# Altium schematic sheet SH31 - POWER II.SchDoc
size 386 x 246 mm
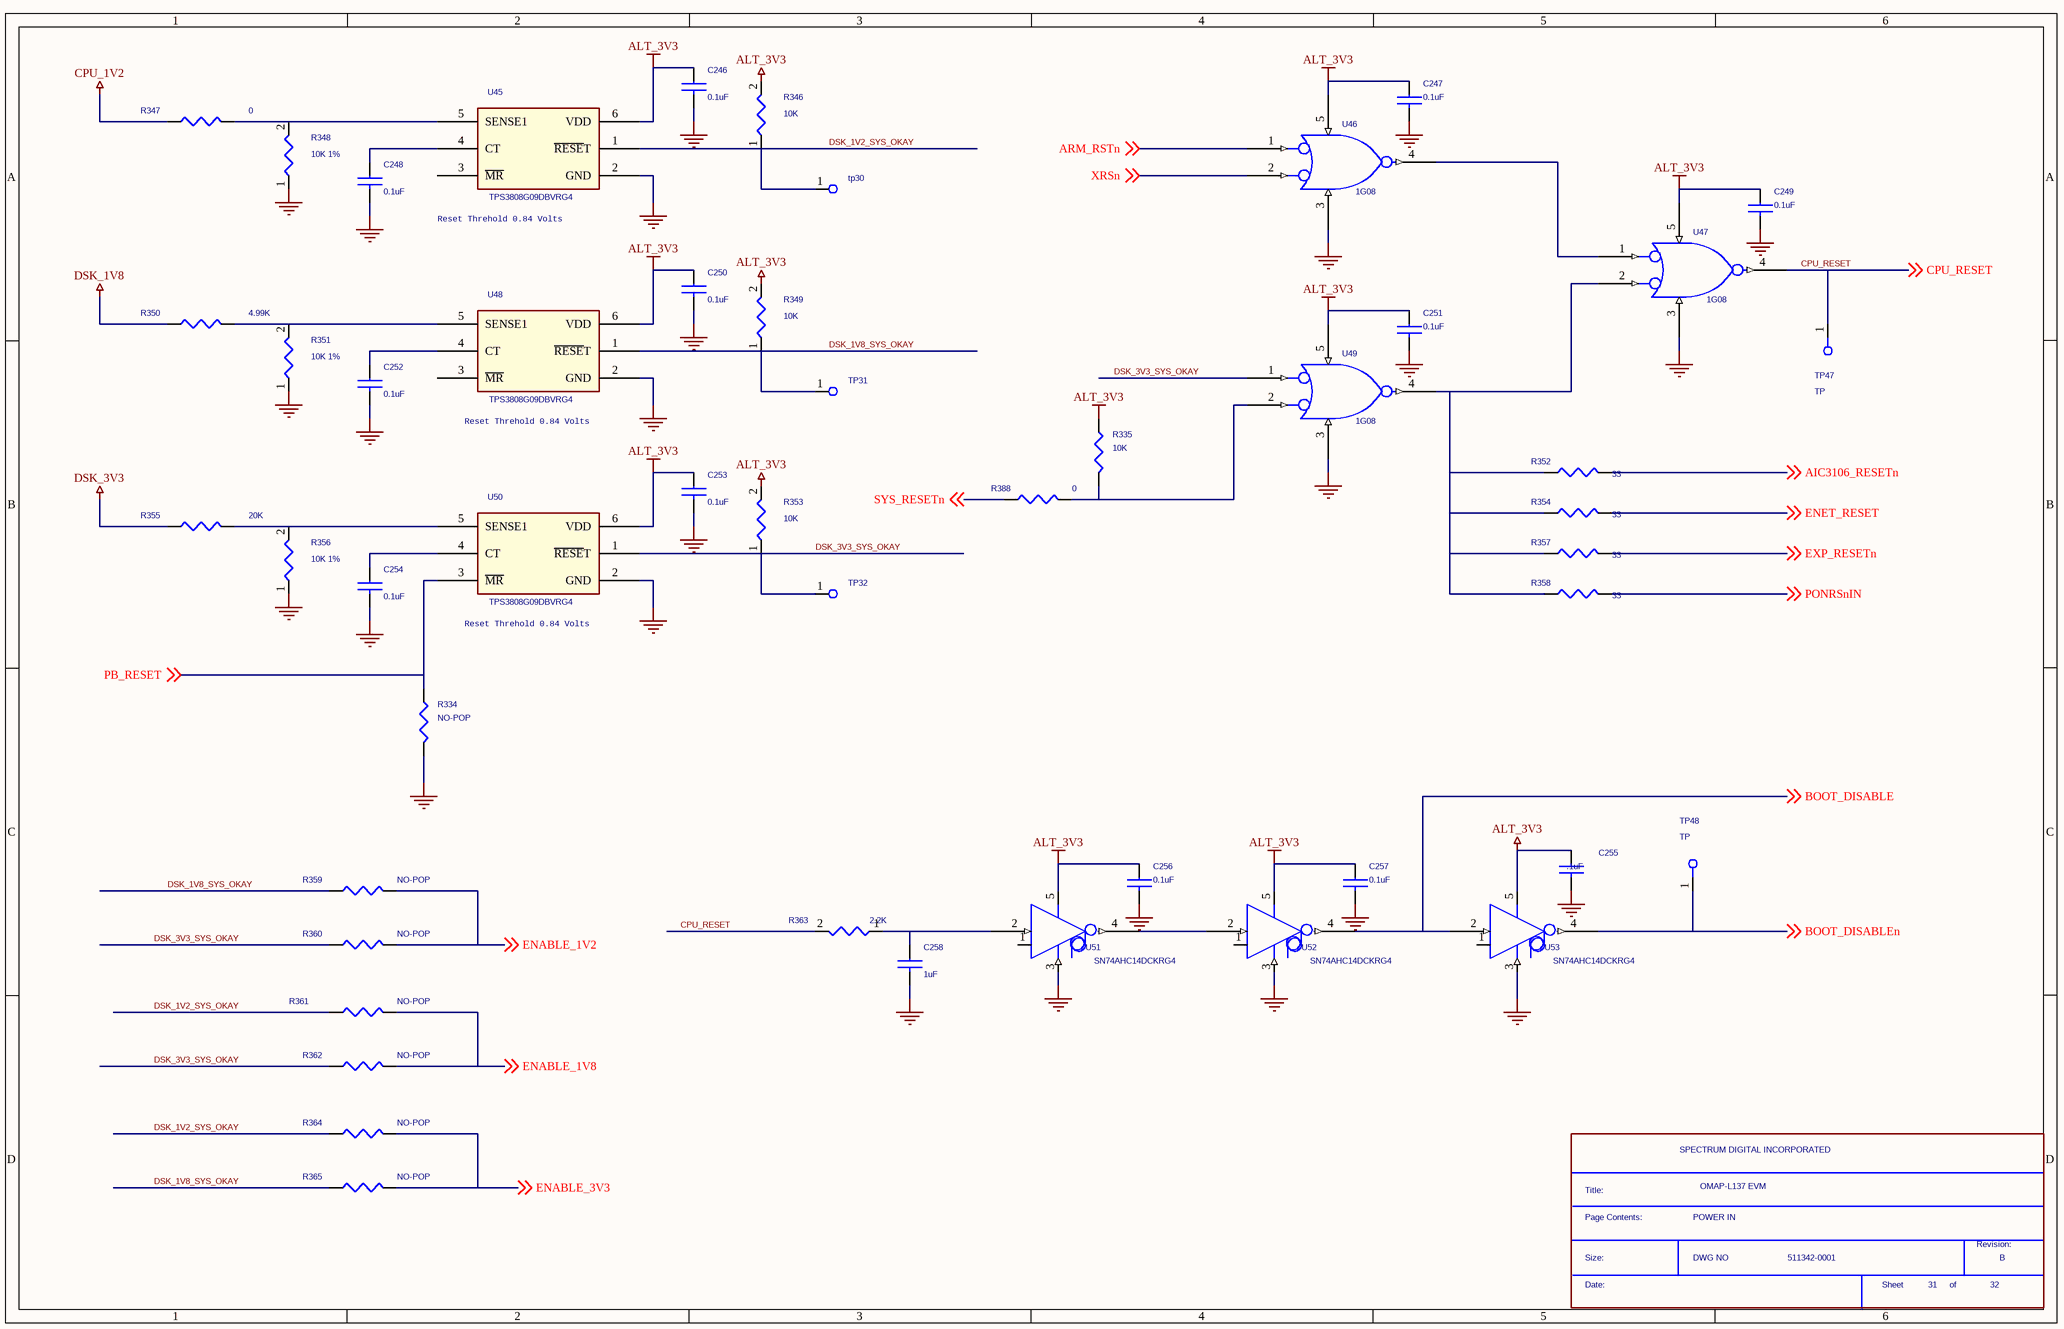
[diagram p0: SH31 - POWER II.SchDoc]

## Parts
*  Page Contents:: POWER IN  RevCode: B  Title: OMAP-L137 EVM  OrgName: SPECTRUM DIGITAL INCORPORATED  Doc: 511342-0001  Page Number: 31  Page Count: 32  (hidden comment: SDTitleBlock)  (graphical)
C246  0.1uF  [c402-25]
C247  0.1uF  [c402-25]
C248  0.1uF  [c402-25]
C249  0.1uF  [c402-25]
C250  0.1uF  [c402-25]
C251  0.1uF  [c402-25]
C252  0.1uF  [c402-25]
C253  0.1uF  [c402-25]
C254  0.1uF  [c402-25]
C255  .1uF  [c402-25]
C256  0.1uF  [c402-25]
C257  0.1uF  [c402-25]
C258  1uF  [c402-25]
R334  NO-POP  [r402-25]
R335  10K  [r402-25]
R346  10K  [r402-25]
R347  0  [r402-25]
R348  10K 1%  [r402-25]
R349  10K  [r402-25]
R350  4.99K  [r603-35x45]
R351  10K 1%  [r402-25]
R352  33  [r402-25]
R353  10K  [r402-25]
R354  33  [r402-25]
R355  20K  [r402-25]
R356  10K 1%  [r402-25]
R357  33  [r402-25]
R358  33  [r402-25]
R359  NO-POP  [r402-25]
R360  NO-POP  [r402-25]
R361  NO-POP  [r402-25]
R362  NO-POP  [r402-25]
R363  2.2K  [r402-25]
R364  NO-POP  [r402-25]
R365  NO-POP  [r402-25]
R388  0  [r402-25]
tp30  TestPoint1  [TP1_0-2_0]  (value not drawn)
TP31  TestPoint1  [TP1_0-2_0]  (value not drawn)
TP32  TestPoint1  [TP1_0-2_0]  (value not drawn)
TP47  TP  [tp1-6040]
TP48  TP  [tp1-6040]
U45  TPS3808G09DBVRG4  [DBV6-27X39-6]
U46  1G08  [SO5]
U47  1G08  [SO5]
U48  TPS3808G09DBVRG4  [DBV6-27X39-6]
U49  1G08  [SO5]
U50  TPS3808G09DBVRG4  [DBV6-27X39-6]
U51  SN74AHC14DCKRG4  [DCK]
U52  SN74AHC14DCKRG4  [DCK]
U53  SN74AHC14DCKRG4  [DCK]

## Nets
ALT_3V3: C246.1 C247.1 C249.1 C250.1 C251.1 C253.1 C255.1 C256.1 C257.1 R335.1 R346.2 R349.2 R353.2 U45.6(VDD) U46.5(VCC) U47.5(VCC) U48.6(VDD) U49.5(VCC) U50.6(VDD) U51.5(VCC) U52.5(VCC) U53.5(VCC)
CPU_1V2: R347.1
DSK_1V8: R350.1
DSK_3V3: R355.1
GND: C246.2 C247.2 C248.2 C249.2 C250.2 C251.2 C252.2 C253.2 C254.2 C255.2 C256.2 C257.2 C258.2 R334.2 R348.1 R351.1 R356.1 U45.2(GND) U46.3(GND) U47.3(GND) U48.2(GND) U49.3(GND) U50.2(GND) U51.3(GND) U52.3(GND) U53.3(GND)
AIC3106_RESETn: R352.1 ; off-sheet AIC3106_RESETn
ARM_RSTn: U46.1(B) ; off-sheet ARM_RSTn
BOOT_DISABLE: U52.4(O) U53.2(I) ; off-sheet BOOT_DISABLE
BOOT_DISABLEn: TP48.1 U53.4(O) ; off-sheet BOOT_DISABLEn
CPU_RESET: R363.2 TP47.1 U47.4(Y) ; off-sheet CPU_RESET
DSK_1V2_SYS_OKAY: R346.1 R361.1 R364.1 tp30.1 U45.1(~{RESE}T)
DSK_1V8_SYS_OKAY: R349.1 R359.1 R365.1 TP31.1 U48.1(~{RESE}T)
DSK_3V3_SYS_OKAY: R353.1 R360.1 R362.1 TP32.1 U49.1(B) U50.1(~{RESE}T)
ENABLE_1V2: R359.2 R360.2 ; off-sheet ENABLE_1V2
ENABLE_1V8: R361.2 R362.2 ; off-sheet ENABLE_1V8
ENABLE_3V3: R364.2 R365.2 ; off-sheet ENABLE_3V3
ENET_RESET: R354.1 ; off-sheet ENET_RESET
EXP_RESETn: R357.1 ; off-sheet EXP_RESETn
PB_RESET: R334.1 U50.3(~{MR}) ; off-sheet PB_RESET
PONRSnIN: R358.1 ; off-sheet PONRSnIN
SYS_RESETn: R388.1 ; off-sheet SYS_RESETn
XRSn: U46.2(A) ; off-sheet XRSn
NetC248_1: C248.1 U45.4(CT)
NetC252_1: C252.1 U48.4(CT)
NetC254_1: C254.1 U50.4(CT)
NetC258_1: C258.1 R363.1 U51.2(I)
NetR335_2: R335.2 R388.2 U49.2(A)
NetR347_2: R347.2 R348.2 U45.5(SENSE1)
NetR350_2: R350.2 R351.2 U48.5(SENSE1)
NetR352_2: R352.2 R354.2 R357.2 R358.2 U47.2(A) U49.4(Y)
NetR355_2: R355.2 R356.2 U50.5(SENSE1)
NetU46_4: U46.4(Y) U47.1(B)
NetU51_4: U51.4(O) U52.2(I)

Not connected (* = marked no-connect by the designer): U45 3(~{MR}); U48 3(~{MR}); U51 1(NC1); U52 1(NC1); U53 1(NC1)

## Notes on the sheet
- (near U45) Reset Threhold 0.84 Volts
- (near U48) Reset Threhold 0.84 Volts
- (near U50) Reset Threhold 0.84 Volts
- (in symbol SDTitleBlock) Title:; Page Contents:; Revision:; Size:; DWG NO; Date:; Sheet; of

## Library data of the parts
C246 C248 C250 C252-C254 C258 = CAP NP_2: Part #: 101587-1100R; SD PCB Footprint: EIA0603
C247 C249 C251 C256 C257 = CAP NP_0: Capacitor, Ceramic, 16V, X7R, 10%; Part #: 101587-1100R
C255 = CAP NP_2: Part #: 101587-1100R
R334 R359-R362 R364 R365 = R: Part #: R0402-NOPOP
R335 = R: Part #: 101370-1003R
R346 R349 R353 = R_2: Part #: 101370-1003R; SD PCB Footprint: EIA0603
R347 R388 = R: Part #: 101370-0001R
R348 R351 R356 = R_2: Part #: 102145-1003R; SD PCB Footprint: EIA0603
R350 = R: Part #: 100642-4992R
R352 R354 R357 R358 = R_1: Resistor, 5%, 1/16W; Part #: 101370-3300R
R355 = R: Part #: 101370-2003R
R363 = R_2: Part #: 101370-2202R; SD PCB Footprint: EIA0603
tp30 TP31 TP32 = TestPoint1: Part #: 100115-0001R; ATLStockNo1: none
TP47 TP48 = TP_0
U45 U48 U50 = TPS3808G09DBVR_0: Part #: 102020-0009R
U46 U47 U49 = 1G08: Part #: 101057-0008R
U51 = SN74LVC1GU04_1: Spectrum Part#: 101027-0125; Part #: 101027-0001R
U52 U53 = SN74LVC1GU04_1: Part #: 101027-0001R; Spectrum Part#: 101027-0125